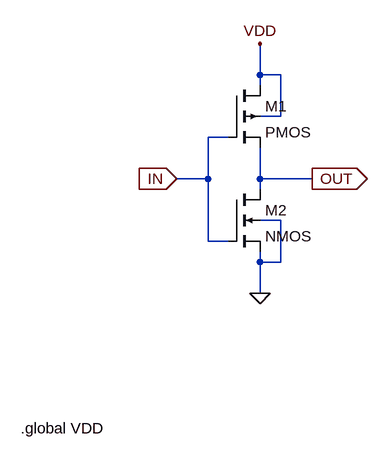
[diagram p0: schematic inverter.asc]
inverter.asc, the LTspice schematic file:
Version 4
SHEET 1 1244 1940
WIRE -48 32 -48 -16
WIRE -16 32 -48 32
WIRE -48 48 -48 32
WIRE -16 96 -16 32
WIRE -16 96 -48 96
WIRE -96 128 -128 128
WIRE -128 192 -128 128
WIRE -128 192 -176 192
WIRE -48 192 -48 144
WIRE 32 192 -48 192
WIRE -48 208 -48 192
WIRE -16 256 -48 256
WIRE -128 288 -128 192
WIRE -96 288 -128 288
WIRE -48 320 -48 304
WIRE -16 320 -16 256
WIRE -16 320 -48 320
WIRE -48 368 -48 320
FLAG -48 368 0
FLAG -48 -16 VDD
FLAG -176 192 IN
IOPIN -176 192 In
FLAG 32 192 OUT
IOPIN 32 192 Out
SYMBOL pmos4 -96 48 R0
SYMATTR InstName M1
SYMATTR Value2 l=0.25u w=0.75u
SYMBOL nmos4 -96 208 R0
SYMATTR InstName M2
SYMATTR Value2 l=0.25u w=0.375u
TEXT -416 576 Left 2 !.global VDD

The netlist it stands for:
* inverter.asc
M1 VDD IN OUT VDD PMOS l=0.25u w=0.75u
M2 OUT IN 0 0 NMOS l=0.25u w=0.375u
.model NMOS NMOS
.model PMOS PMOS
.lib standard.mos
.global VDD
.backanno
.end